# Altium schematic sheet BMS AFE - Connectors.SchDoc: Title
size B; Organization: Midnight Sun Solar Rayce Car Team; Address1: University of Waterloo; Address2: 200 University Ave W; Address3: Waterloo, ON, Canada; Address4: N2L 3E9; DocumentNumber: 2; SheetNumber: 2; SheetTotal: 7; Website: www.uwmidsun.com; ProjectName: ProjectName
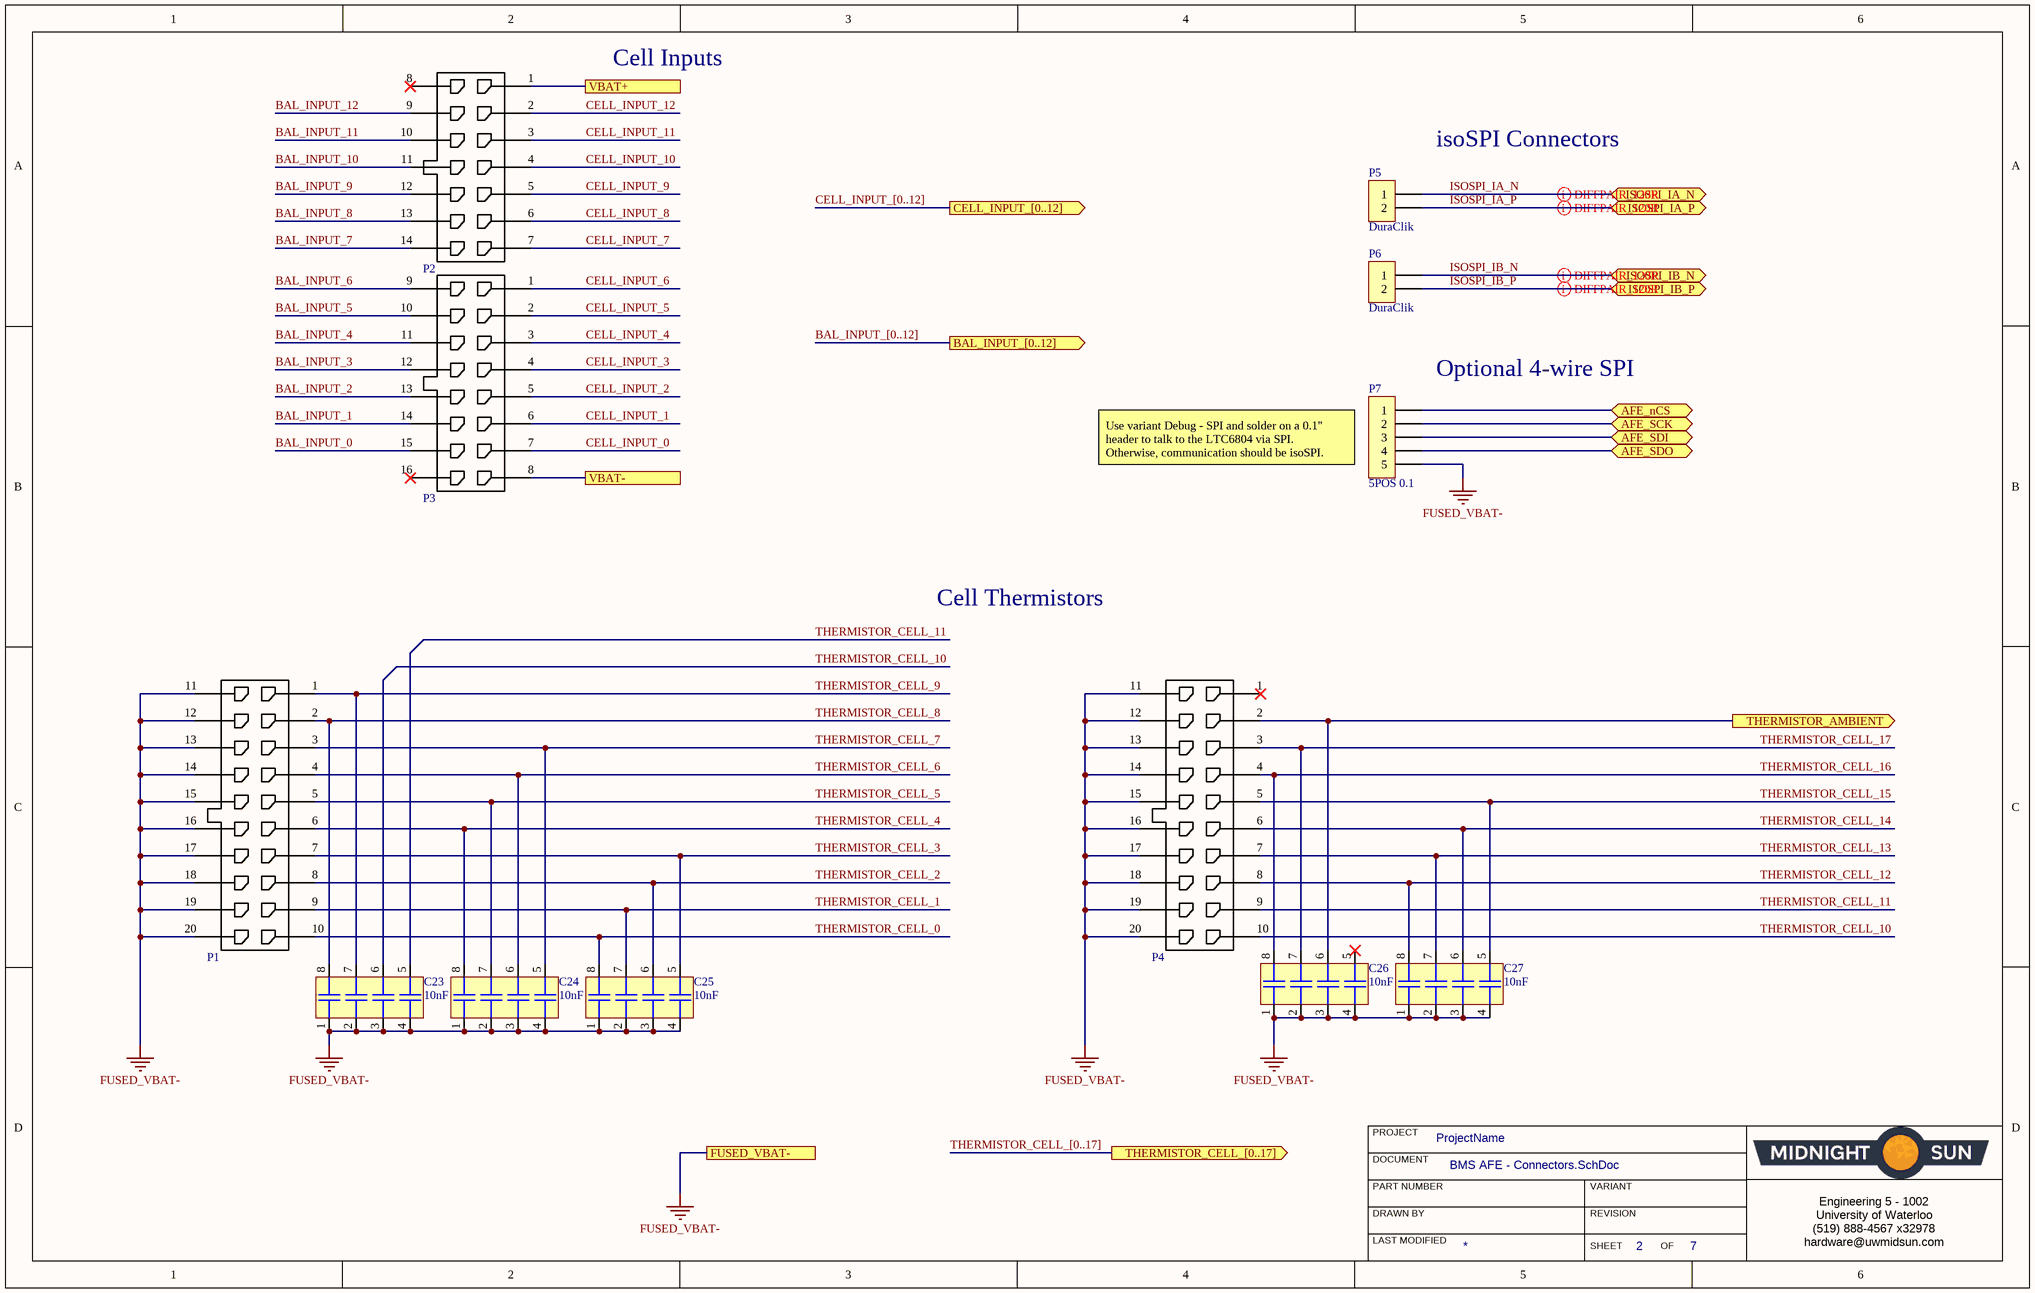
[diagram p0: BMS AFE - Connectors.SchDoc]

## Parts
C23  Capacitance: 10nF  [CAP ARRAY 4 POS 0612]  (hidden comment: CAP ARRAY 10000PF 50V X7R 0612)
C24  Capacitance: 10nF  [CAP ARRAY 4 POS 0612]  (hidden comment: CAP ARRAY 10000PF 50V X7R 0612)
C25  Capacitance: 10nF  [CAP ARRAY 4 POS 0612]  (hidden comment: CAP ARRAY 10000PF 50V X7R 0612)
C26  Capacitance: 10nF  [CAP ARRAY 4 POS 0612]  (hidden comment: CAP ARRAY 10000PF 50V X7R 0612)
C27  Capacitance: 10nF  [CAP ARRAY 4 POS 0612]  (hidden comment: CAP ARRAY 10000PF 50V X7R 0612)
P1  CONN R/A 20POS 3MM  [CONN, R/A 20POS MICRO-FIT 3mm]  (value not drawn)
P2  CONN R/A 14POS 3MM  [CONN, R/A 14POS MICRO-FIT 3mm]  (value not drawn)
P3  CONN R/A 16POS 3MM  [CONN, R/A 16POS MICRO-FIT 3mm]  (value not drawn)
P4  CONN R/A 20POS 3MM  [CONN, R/A 20POS MICRO-FIT 3mm]  (value not drawn)
P5  Series: DuraClik  [CONN, 2POS Dura-Click]  (hidden comment: CONN 2POS DURA-CLIK 0.079")
P6  Series: DuraClik  [CONN, 2POS Dura-Click]  (hidden comment: CONN 2POS DURA-CLIK 0.079")
P7  5POS 0.1  [CONN, 5POS HEADR 0.1"]

## Ports
AFE_nCS (bidir), AFE_SCK (bidir), AFE_SDI (bidir), AFE_SDO (bidir), BAL_INPUT_[0..12] (out), CELL_INPUT_[0..12] (out), FUSED_VBAT-, ISOSPI_IA_N (bidir), ISOSPI_IA_P (bidir), ISOSPI_IB_N (bidir), ISOSPI_IB_P (bidir), THERMISTOR_AMBIENT (out), THERMISTOR_CELL_[0..17] (out), VBAT+, VBAT-

## Nets
FUSED_VBAT-: C23.1 C23.2 C23.3 C23.4 C24.1 C24.2 C24.3 C24.4 C25.1 C25.2 C25.3 C25.4 C26.1 C26.2 C26.3 C26.4 C27.1 C27.2 C27.3 C27.4 P1.11 P1.12 P1.13 P1.14 P1.15 P1.16 P1.17 P1.18 P1.19 P1.20 P4.11 P4.12 P4.13 P4.14 P4.15 P4.16 P4.17 P4.18 P4.19 P4.20 P7.5 ; port FUSED_VBAT-
AFE_nCS: P7.1 ; port AFE_nCS
AFE_SCK: P7.2 ; port AFE_SCK
AFE_SDI: P7.3 ; port AFE_SDI
AFE_SDO: P7.4 ; port AFE_SDO
BAL_INPUT_0: P3.15
BAL_INPUT_1: P3.14
BAL_INPUT_2: P3.13
BAL_INPUT_3: P3.12
BAL_INPUT_4: P3.11
BAL_INPUT_5: P3.10
BAL_INPUT_6: P3.9
BAL_INPUT_7: P2.14
BAL_INPUT_8: P2.13
BAL_INPUT_9: P2.12
BAL_INPUT_10: P2.11
BAL_INPUT_11: P2.10
BAL_INPUT_12: P2.9
CELL_INPUT_0: P3.7
CELL_INPUT_1: P3.6
CELL_INPUT_2: P3.5
CELL_INPUT_3: P3.4
CELL_INPUT_4: P3.3
CELL_INPUT_5: P3.2
CELL_INPUT_6: P3.1
CELL_INPUT_7: P2.7
CELL_INPUT_8: P2.6
CELL_INPUT_9: P2.5
CELL_INPUT_10: P2.4
CELL_INPUT_11: P2.3
CELL_INPUT_12: P2.2
ISOSPI_IA_N: P5.1 ; port ISOSPI_IA_N
ISOSPI_IA_P: P5.2 ; port ISOSPI_IA_P
ISOSPI_IB_N: P6.1 ; port ISOSPI_IB_N
ISOSPI_IB_P: P6.2 ; port ISOSPI_IB_P
THERMISTOR_AMBIENT: C26.6 P4.2 ; port THERMISTOR_AMBIENT
THERMISTOR_CELL_0: C25.8 P1.10
THERMISTOR_CELL_1: C25.7 P1.9
THERMISTOR_CELL_2: C25.6 P1.8
THERMISTOR_CELL_3: C25.5 P1.7
THERMISTOR_CELL_4: C24.8 P1.6
THERMISTOR_CELL_5: C24.7 P1.5
THERMISTOR_CELL_6: C24.6 P1.4
THERMISTOR_CELL_7: C24.5 P1.3
THERMISTOR_CELL_8: C23.8 P1.2
THERMISTOR_CELL_9: C23.7 P1.1
THERMISTOR_CELL_10: C23.6 P4.10
THERMISTOR_CELL_11: C23.5 P4.9
THERMISTOR_CELL_12: C27.8 P4.8
THERMISTOR_CELL_13: C27.7 P4.7
THERMISTOR_CELL_14: C27.6 P4.6
THERMISTOR_CELL_15: C27.5 P4.5
THERMISTOR_CELL_16: C26.8 P4.4
THERMISTOR_CELL_17: C26.7 P4.3
VBAT+: P2.1 ; port VBAT+
VBAT-: P3.8 ; port VBAT-

Not connected (* = marked no-connect by the designer): C26 5*; P2 8*; P3 16*; P4 1*

## Buses and harness runs
bus BAL_INPUT_[0..12] = port BAL_INPUT_[0..12]
bus CELL_INPUT_[0..12] = port CELL_INPUT_[0..12]
bus THERMISTOR_CELL_[0..17] = port THERMISTOR_CELL_[0..17]

## Layout directives
differential pair: ISOSPI_IA_N, ISOSPI_IA_P, ISOSPI_IB_N, ISOSPI_IB_P

## Notes on the sheet
- Cell Inputs
- isoSPI Connectors
- (near P7) Optional 4-wire SPI
- (near P7) Use variant Debug - SPI and solder on a 0.1" header to talk to the LTC6804 via SPI. Otherwise, communication should be isoSPI.
- Cell Thermistors
- PROJECT
- DOCUMENT
- DRAWN BY
- LAST MODIFIED
- PART NUMBER
- REVISION
- SHEET
- VARIANT
- OF
- Engineering 5 - 1002
  University of Waterloo
  (519) 888-4567 x32978
  hardware@uwmidsun.com

## Library data of the parts
C23-C27 = CAP ARRAY 10000PF 50V X7R 0612: 10000pF Isolated Capacitor  Array 50V X7R 0612 (1632 Metric); Manufacturer: Yageo; Manufacturer Part Number: CA0612KRX7R9BB103; Dielectric Material: Ceramic; Tolerance: 10%; Number of Capacitors: 4; Description: Cap Ceramic Array 0.01uF 50V X7R 10% 0612 SMD 4 Capacitor 125C Automotive T/R; Mount: Surface Mount; Case/Package: 0612; Case Code (Metric): 1632; Case Code (Imperial): 0612; Number of Terminals: 8; Min Operating Temperature: -55°C; Max Operating Temperature: 125°C; Package Quantity: 4000; Voltage Rating: 50V; Packaging: Tape and Reel; Dielectric: X7R; Circuit Type: Isolated; Termination: SMD/SMT; Composition: Ceramic; Voltage Rating (DC): 50V; Length: 3.2mm; Height: 0.8mm; Width: 0.063inch; Height - Seated (Max): 0.035inch; Terminal Pitch: 0.8mm; Depth: 1.6mm; Radiation Hardening: No; Lead Free: Lead Free; ComponentLink1URL: https://datasheet.ciiva.com/129/upy-4c-array-16v-to-50v-3-129442.pdf?src-supplier=Digi-Key; ComponentLink1Description: https://datasheet.ciiva.com/129/upy-4c-array-16v-to-50v-3-129442.pdf?src-supplier=Digi-Key; ComponentLink2URL: https://datasheet.ciiva.com/16747/ca0508jrnpo9bn150-16747477.pdf?src-supplier=Future+Electronics; ComponentLink2Description: https://datasheet.ciiva.com/16747/ca0508jrnpo9bn150-16747477.pdf?src-supplier=Future+Electronics; ComponentLink3URL: https://datasheet.ciiva.com/15189/getdatasheetpartid-371163-15189099.pdf?src-supplier=Verical; ComponentLink3Description: https://datasheet.ciiva.com/15189/getdatasheetpartid-371163-15189099.pdf?src-supplier=Verical; Pricing 1: 1=0.41000, 10=0.28300, 100=0.16970, 500=0.12728, 1000=0.10749 (USD); RoHS: Yes; Stock 1: 4330; Supplier 1: Digi-Key; Supplier Part Number 1: 311-2074-1-ND
P1 P4 = CONN R/A 20POS 3MM: Connector Header Through Hole, Right Angle 20 position 0.118" (3.00mm); Manufacturer: Molex; Manufacturer Part Number: 0430452021; Number of Positions: 20; Connector Type: Male Pin; Contact Resistance: 10mR; Row Spacing: 0.118inch; Description: Conn Wire to Board HDR 20 POS 3mm Solder RA Thru-Hole Micro-Fit 3.0™ Tray; Mount: Through Hole; Contact Plating: Tin; Color: Black; Contact Material: Brass; Housing Material: Polymer; Housing Color: Black; Min Operating Temperature: -40°C; Max Operating Temperature: 105°C; Packaging: Tray; Number of Rows: 2; Termination: Solder; Orientation: Right Angle; Fastening Type: Ramp; Number of Contacts: 20; Length: 34.15mm; Pitch: 3mm; Depth: 12.2mm; ComponentLink1URL: https://datasheet.ciiva.com/6841/430450223-sd-6841489.pdf?src-supplier=Digi-Key; ComponentLink1Description: https://datasheet.ciiva.com/6841/430450223-sd-6841489.pdf?src-supplier=Digi-Key; ComponentLink2URL: https://datasheet.ciiva.com/10077/0430452021-pcb-headers-10077829.pdf?src-supplier=Avnet; ComponentLink2Description: https://datasheet.ciiva.com/10077/0430452021-pcb-headers-10077829.pdf?src-supplier=Avnet; Pricing 1: 1=5.68000, 10=5.44900, 25=4.99520, 50=4.76820, 100=4.54120, 250=3.97356, 648=3.86002, 1296=3.29237, 2592=3.06531 (USD); RoHS: Yes; Stock 1: 1054; Supplier 1: Digi-Key; Supplier Part Number 1: WM20137-ND
P2 = CONN R/A 14POS 3MM: Connector Header Through Hole, Right Angle 14 position 0.118" (3.00mm); Manufacturer: Molex; Manufacturer Part Number: 0430451421; Number of Positions: 14; Contact Resistance: 10mR; Connector Type: Male Pin; Max Voltage Rating (AC): 250V; Row Spacing: 0.118inch; Description: Conn Wire to Board HDR 14 POS 3mm Solder RA Thru-Hole Micro-Fit 3.0™ Tray; Mount: Through Hole; Contact Plating: Tin; Color: Black; Contact Material: Brass; Housing Material: Polymer; Housing Color: Black; Min Operating Temperature: -40°C; Max Operating Temperature: 105°C; Packaging: Tray; Number of Rows: 2; Termination: Solder; Number of Contacts: 14; Package Quantity: 936; Orientation: Right Angle; Fastening Type: Ramp; Max Voltage Rating (DC): 250V; Length: 25.15mm; Pitch: 3mm; Depth: 12.2mm; ComponentLink1URL: https://datasheet.ciiva.com/6841/430450223-sd-6841489.pdf?src-supplier=Digi-Key; ComponentLink1Description: https://datasheet.ciiva.com/6841/430450223-sd-6841489.pdf?src-supplier=Digi-Key; Pricing 1: 1=4.12000, 10=3.95700, 25=3.62760, 50=3.46260, 100=3.29780, 250=2.88556, 936=2.55579, 1872=2.30846, 2808=2.22601 (USD); RoHS: Yes; Stock 1: 776; Supplier 1: Digi-Key; Supplier Part Number 1: WM14571-ND
P3 = CONN R/A 16POS 3MM: Connector Header Through Hole, Right Angle 16 position 0.118" (3.00mm); Manufacturer Part Number: 0430451621; Manufacturer: Molex; Contact Resistance: 10mR; Number of Positions: 16; Connector Type: Male Pin; Row Spacing: 0.118inch; Mount: Through Hole; Contact Plating: Tin; Contact Material: Brass; Color: Black; Housing Material: Polymer; Housing Color: Black; Min Operating Temperature: -40°C; Max Operating Temperature: 105°C; Packaging: Tray; Number of Rows: 2; Termination: Solder; Number of Contacts: 16; Orientation: Right Angle; Package Quantity: 792; Fastening Type: Ramp; Length: 28.15mm; Pitch: 3mm; Depth: 12.2mm; ComponentLink1URL: https://datasheet.ciiva.com/6841/430450223-sd-6841489.pdf?src-supplier=Digi-Key; ComponentLink1Description: https://datasheet.ciiva.com/6841/430450223-sd-6841489.pdf?src-supplier=Digi-Key; Pricing 1: 1=4.58000, 10=4.39500, 25=4.02880, 50=3.84560, 100=3.66240, 250=3.20460, 792=2.83836, 1584=2.56368, 3168=2.47212 (USD); RoHS: Yes; Stock 1: 701; Supplier 1: Digi-Key; Supplier Part Number 1: WM14573-ND
P5 P6 = CONN 2POS DURA-CLIK 0.079": 2 Positions Header, Shrouded Connector 0.079" (2.00mm) Surface Mount, Right Angle Tin; Manufacturer 1: Molex, LLC; Manufacturer Part Number 1: 5023520200; Style: Board to Cable/Wire; Shrouding: Shrouded - 4 Wall; Number of Positions: 2; Number of Positions Loaded: All; Contact Length - Mating: 0.135" (3.45mm); Material Flammability Rating: UL94 V-0; Mated Stacking Heights: 11mm; Supplier 1: Digi-Key; Supplier Part Number 1: WM7169CT-ND; Packaging: Cut Tape (CT); Part Status: Active; Connector Type: Header; Contact Type: Male Pin; Number of Rows: 1; Row Spacing - Mating: -; Mounting Type: Surface Mount, Right Angle; Termination: Solder; Fastening Type: Latch Lock; Contact Length - Post: -; Overall Contact Length: -; Insulation Height: 0.252" (6.40mm); Contact Shape: Square; Contact Finish - Mating: Tin; Contact Finish Thickness - Mating: -; Contact Finish - Post: Tin; Contact Material: Copper Alloy; Insulation Material: Polyamide (PA), Nylon; Operating Temperature: -; Ingress Protection: -; Insulation Color: Natural; Current Rating: -; Contact Finish Thickness - Post: -; ComponentLink1URL: http://www.molex.com/pdm_docs/sd/5023520200_sd.pdf; ComponentLink1Description: http://www.molex.com/pdm_docs/sd/5023520200_sd.pdf; Voltage: -; Pitch - Mating: 0.079" (2.00mm)
P7 = CONN 5POS HEADR MALE 0.1in: 5 Positions Header, Breakaway Connector 0.100" (2.54mm) Through Hole Tin; Manufacturer 1: Molex; Manufacturer Part Number 1: 0022284050; Description 1: Conn Unshrouded Header HDR 5 POS 2.54mm Solder ST Thru-Hole KK® Bag; Contact Resistance: 20mR; Number of Positions: 5; Gender: Male; Connector Type: Male Pin; Max Voltage Rating (AC): 250V; Supplier 1: Digi-Key; Supplier Part Number 1: WM50014-05-ND; Stock 1: 3161; Pricing 1: 1=0.22, 10=0.21, 25=0.1796, 50=0.157, 100=0.1459, 250=0.129, 500=0.1234 (USD); Mount: Through Hole; Colour: Black; Contact Plating: Nickel,Tin; Contact Material: Bronze,Brass; Housing Colour: Black; Housing Material: Nylon; Min Operating Temperature: 0°C; Max Operating Temperature: 75°C; Packaging: Bulk; Number of Rows: 1; Termination: Solder; Number of Contacts: 5; Orientation: Straight; Max Voltage Rating (DC): 250V; Length: 12.7mm; Pitch: 2.54mm; Depth: 2.49mm; Contact Mating Length: 0.24inch; ComponentLink1URL: https://datasheet.ciiva.com/6814/022284363-sd-6814049.pdf; ComponentLink1Description: https://datasheet.ciiva.com/6814/022284363-sd-6814049.pdf; ComponentLink2URL: https://datasheet.ciiva.com/14804/179390022284050-pcb-headers-14804361.pdf; ComponentLink2Description: https://datasheet.ciiva.com/14804/179390022284050-pcb-headers-14804361.pdf; ComponentLink3URL: https://datasheet.ciiva.com/15217/getdatasheetpartid-256138-15217709.pdf; ComponentLink3Description: https://datasheet.ciiva.com/15217/getdatasheetpartid-256138-15217709.pdf